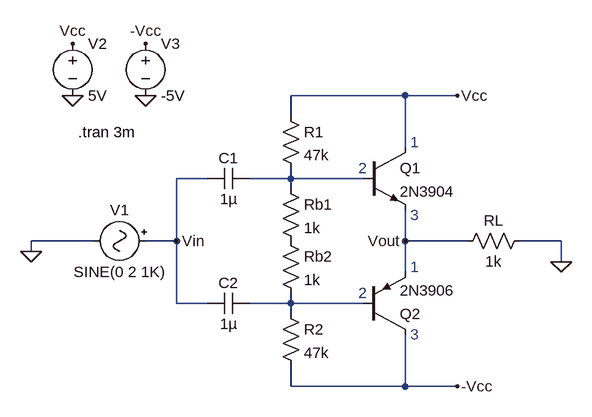
[diagram p0: schematic class-b-transformerless.asc]
class-b-transformerless.asc, the LTspice schematic file:
Version 4
SHEET 1 880 680
WIRE 256 48 80 48
WIRE 336 48 256 48
WIRE 80 80 80 48
WIRE 256 128 256 48
WIRE -48 176 -96 176
WIRE 80 176 80 160
WIRE 80 176 16 176
WIRE 192 176 80 176
WIRE 80 192 80 176
WIRE -224 272 -320 272
WIRE -96 272 -96 176
WIRE -96 272 -144 272
WIRE 256 272 256 224
WIRE 352 272 256 272
WIRE 496 272 432 272
WIRE -320 288 -320 272
WIRE 496 304 496 272
WIRE 256 320 256 272
WIRE -96 368 -96 272
WIRE -48 368 -96 368
WIRE 80 368 80 352
WIRE 80 368 16 368
WIRE 192 368 80 368
WIRE 80 384 80 368
WIRE 80 496 80 464
WIRE 256 496 256 416
WIRE 256 496 80 496
WIRE 336 496 256 496
FLAG 496 304 0
FLAG 336 48 Vcc
FLAG 336 496 -Vcc
FLAG -320 288 0
FLAG -256 48 0
FLAG -144 48 0
FLAG -256 -32 Vcc
FLAG -144 -32 -Vcc
FLAG -96 272 Vin
FLAG 256 272 Vout
SYMBOL npn 192 128 R0
SYMATTR InstName Q1
SYMATTR Value 2N3904
SYMBOL pnp 192 416 M180
SYMATTR InstName Q2
SYMATTR Value 2N3906
SYMBOL res 64 176 R0
SYMATTR InstName Rb1
SYMATTR Value 1k
SYMBOL res 64 256 R0
SYMATTR InstName Rb2
SYMATTR Value 1k
SYMBOL res 64 368 R0
SYMATTR InstName R2
SYMATTR Value 47k
SYMBOL res 64 64 R0
SYMATTR InstName R1
SYMATTR Value 47k
SYMBOL res 448 256 R90
WINDOW 0 0 56 VBottom 2
WINDOW 3 32 56 VTop 2
SYMATTR InstName RL
SYMATTR Value 1k
SYMBOL cap 16 160 R90
WINDOW 0 0 32 VBottom 2
WINDOW 3 32 32 VTop 2
SYMATTR InstName C1
SYMATTR Value 1µ
SYMBOL cap 16 352 R90
WINDOW 0 0 32 VBottom 2
WINDOW 3 32 32 VTop 2
SYMATTR InstName C2
SYMATTR Value 1µ
SYMBOL Misc\\signal -128 272 R90
WINDOW 0 -32 56 VBottom 2
WINDOW 3 32 56 VTop 2
WINDOW 123 0 0 Left 0
WINDOW 39 0 0 Left 0
SYMATTR InstName V1
SYMATTR Value SINE(0 2 1K)
SYMBOL voltage -256 -48 R0
WINDOW 123 0 0 Left 0
WINDOW 39 0 0 Left 0
SYMATTR InstName V2
SYMATTR Value 5V
SYMBOL voltage -144 -48 R0
WINDOW 123 0 0 Left 0
WINDOW 39 0 0 Left 0
SYMATTR InstName V3
SYMATTR Value -5V
TEXT -248 104 Left 2 !.tran 3m
TEXT 264 120 Left 2 ;1
TEXT 184 160 Left 2 ;2
TEXT 264 232 Left 2 ;3
TEXT 264 312 Left 2 ;1
TEXT 184 352 Left 2 ;2
TEXT 264 416 Left 2 ;3

The netlist it stands for:
* class-b-transformerless.asc
Q1 Vcc N001 Vout 0 2N3904
Q2 -Vcc N002 Vout 0 2N3906
Rb1 N001 P001 1k
Rb2 P001 N002 1k
R2 N002 -Vcc 47k
R1 Vcc N001 47k
RL 0 Vout 1k
C1 N001 Vin 1µ
C2 N002 Vin 1µ
V1 Vin 0 SINE(0 2 1K)
V2 Vcc 0 5V
V3 -Vcc 0 -5V
.model NPN NPN
.model PNP PNP
.lib standard.bjt
.tran 3m
* 1
* 2
* 3
* 1
* 2
* 3
.backanno
.end